# EAGLE design fib_backplate (EAGLE 9.5.1)
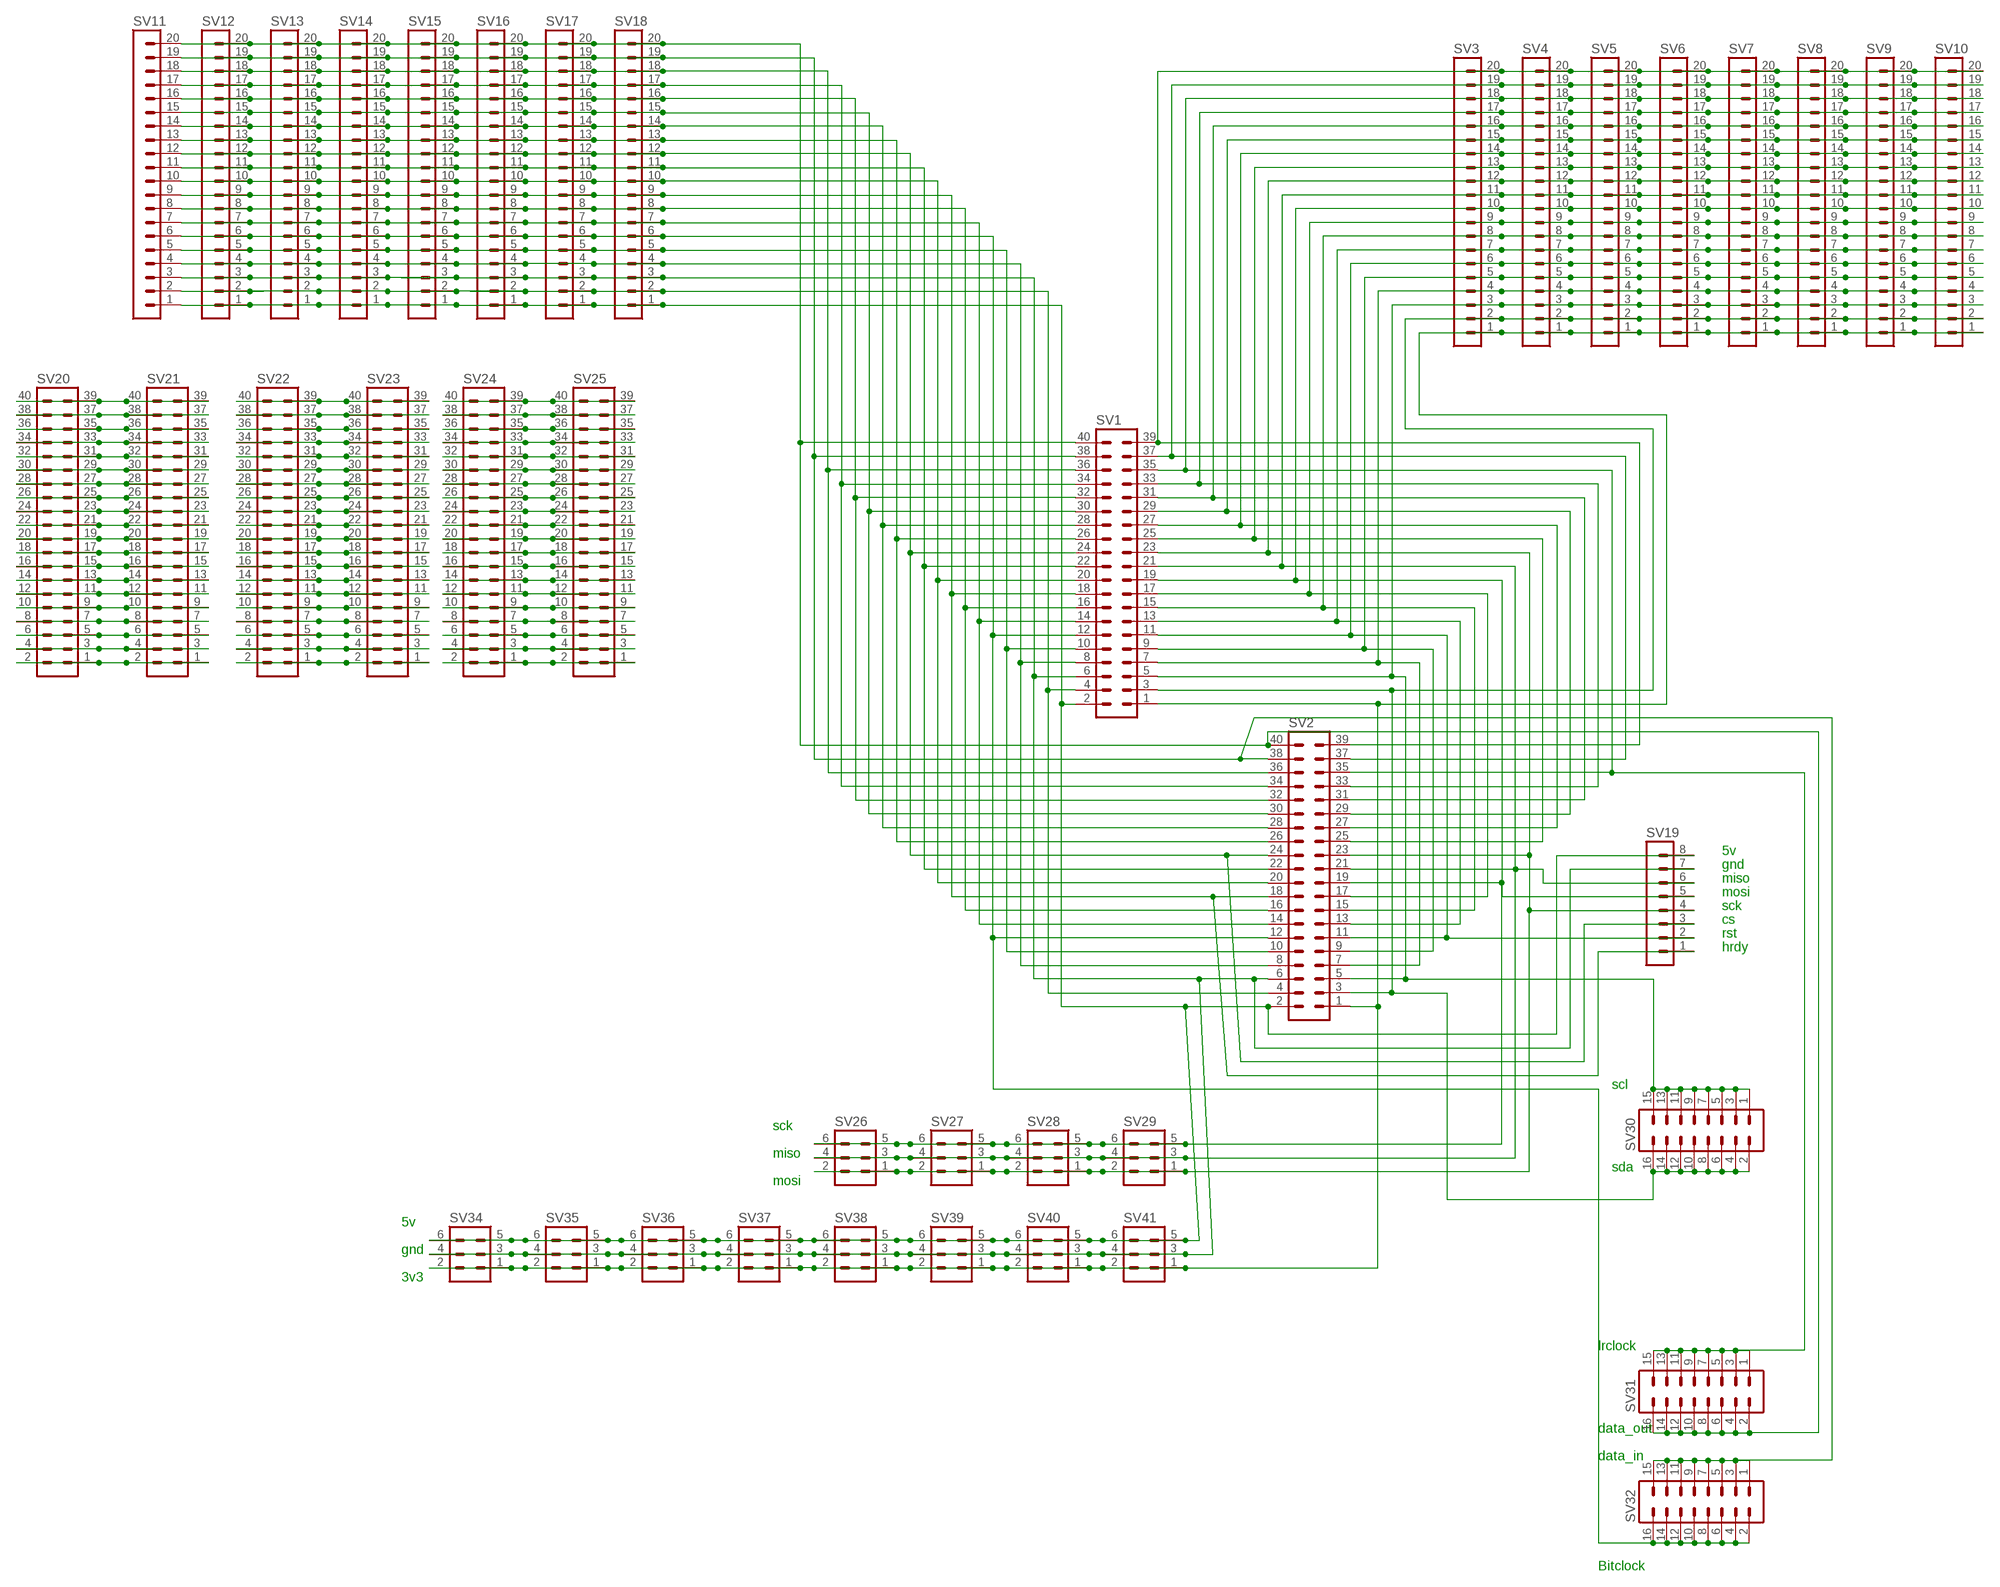
[diagram p0: schematic, sheet 1]

## Parts
SV1  MA20-2  [MA20-2]
SV2  MA20-2  [MA20-2]
SV3  MA20-1L  [MA20-1L]
SV4  MA20-1L  [MA20-1L]
SV5  MA20-1L  [MA20-1L]
SV6  MA20-1L  [MA20-1L]
SV7  MA20-1L  [MA20-1L]
SV8  MA20-1L  [MA20-1L]
SV9  MA20-1L  [MA20-1L]
SV10  MA20-1L  [MA20-1L]
SV11  MA20-1L  [MA20-1L]
SV12  MA20-1L  [MA20-1L]
SV13  MA20-1L  [MA20-1L]
SV14  MA20-1L  [MA20-1L]
SV15  MA20-1L  [MA20-1L]
SV16  MA20-1L  [MA20-1L]
SV17  MA20-1L  [MA20-1L]
SV18  MA20-1L  [MA20-1L]
SV19  MA08-1  [MA08-1]
SV20  MA20-2  [MA20-2]
SV21  MA20-2  [MA20-2]
SV22  MA20-2  [MA20-2]
SV23  MA20-2  [MA20-2]
SV24  MA20-2  [MA20-2]
SV25  MA20-2  [MA20-2]
SV26  MA03-2  [MA03-2]
SV27  MA03-2  [MA03-2]
SV28  MA03-2  [MA03-2]
SV29  MA03-2  [MA03-2]
SV30  MA08-2  [MA08-2]
SV31  MA08-2  [MA08-2]
SV32  MA08-2  [MA08-2]
SV34  MA03-2  [MA03-2]
SV35  MA03-2  [MA03-2]
SV36  MA03-2  [MA03-2]
SV37  MA03-2  [MA03-2]
SV38  MA03-2  [MA03-2]
SV39  MA03-2  [MA03-2]
SV40  MA03-2  [MA03-2]
SV41  MA03-2  [MA03-2]

## Nets
N$1 [Tracks]: SV1.4 SV2.4 SV11.2 SV12.2 SV13.2 SV14.2 SV15.2 SV16.2 SV17.2 SV18.2
N$3 [Tracks]: SV1.8 SV2.8 SV11.4 SV12.4 SV13.4 SV14.4 SV15.4 SV16.4 SV17.4 SV18.4
N$4 [Tracks]: SV1.10 SV2.10 SV11.5 SV12.5 SV13.5 SV14.5 SV15.5 SV16.5 SV17.5 SV18.5
N$5 [Tracks]: SV1.35 SV2.35 SV3.18 SV4.18 SV5.18 SV6.18 SV7.18 SV8.18 SV9.18 SV10.18 SV31.1 SV31.3 SV31.5 SV31.7 SV31.9 SV31.11 SV31.13 SV31.15
N$7 [Tracks]: SV1.12 SV2.12 SV11.6 SV12.6 SV13.6 SV14.6 SV15.6 SV16.6 SV17.6 SV18.6 SV32.2 SV32.4 SV32.6 SV32.8 SV32.10 SV32.12 SV32.14 SV32.16
N$8 [Tracks]: SV1.14 SV2.14 SV11.7 SV12.7 SV13.7 SV14.7 SV15.7 SV16.7 SV17.7 SV18.7
N$9 [Tracks]: SV1.5 SV2.5 SV3.3 SV4.3 SV5.3 SV6.3 SV7.3 SV8.3 SV9.3 SV10.3 SV30.1 SV30.3 SV30.5 SV30.7 SV30.9 SV30.11 SV30.13 SV30.15
N$10 [Tracks]: SV1.7 SV2.7 SV3.4 SV4.4 SV5.4 SV6.4 SV7.4 SV8.4 SV9.4 SV10.4
N$11 [Tracks]: SV1.9 SV2.9 SV3.5 SV4.5 SV5.5 SV6.5 SV7.5 SV8.5 SV9.5 SV10.5
N$12 [Tracks]: SV20.39 SV20.40 SV21.39 SV21.40
N$13 [Tracks]: SV1.11 SV2.11 SV3.6 SV4.6 SV5.6 SV6.6 SV7.6 SV8.6 SV9.6 SV10.6 SV19.2
N$14 [Tracks]: SV1.18 SV2.18 SV11.9 SV12.9 SV13.9 SV14.9 SV15.9 SV16.9 SV17.9 SV18.9 SV19.1
N$15 [Tracks]: SV20.37 SV20.38 SV21.37 SV21.38
N$16 [Tracks]: SV1.13 SV2.13 SV3.7 SV4.7 SV5.7 SV6.7 SV7.7 SV8.7 SV9.7 SV10.7
N$17 [Tracks]: SV1.22 SV2.22 SV11.11 SV12.11 SV13.11 SV14.11 SV15.11 SV16.11 SV17.11 SV18.11
N$18 [Tracks]: SV1.15 SV2.15 SV3.8 SV4.8 SV5.8 SV6.8 SV7.8 SV8.8 SV9.8 SV10.8
N$19 [Tracks]: SV20.35 SV20.36 SV21.35 SV21.36
N$20 [Tracks]: SV1.17 SV2.17 SV3.9 SV4.9 SV5.9 SV6.9 SV7.9 SV8.9 SV9.9 SV10.9
N$21 [Tracks]: SV20.33 SV20.34 SV21.33 SV21.34
N$22 [Tracks]: SV1.25 SV2.25 SV3.13 SV4.13 SV5.13 SV6.13 SV7.13 SV8.13 SV9.13 SV10.13
N$23 [Tracks]: SV20.31 SV20.32 SV21.31 SV21.32
N$25 [Tracks]: SV20.29 SV20.30 SV21.29 SV21.30
N$27 [Tracks]: SV20.27 SV20.28 SV21.27 SV21.28
N$28 [Tracks]: SV1.27 SV2.27 SV3.14 SV4.14 SV5.14 SV6.14 SV7.14 SV8.14 SV9.14 SV10.14
N$29 [Tracks]: SV20.25 SV20.26 SV21.25 SV21.26
N$30 [Tracks]: SV1.29 SV2.29 SV3.15 SV4.15 SV5.15 SV6.15 SV7.15 SV8.15 SV9.15 SV10.15
N$31 [Tracks]: SV1.31 SV2.31 SV3.16 SV4.16 SV5.16 SV6.16 SV7.16 SV8.16 SV9.16 SV10.16
N$32 [Tracks]: SV20.23 SV20.24 SV21.23 SV21.24
N$33 [Tracks]: SV20.21 SV20.22 SV21.21 SV21.22
N$34 [Tracks]: SV1.28 SV2.28 SV11.14 SV12.14 SV13.14 SV14.14 SV15.14 SV16.14 SV17.14 SV18.14
N$35 [Tracks]: SV1.33 SV2.33 SV3.17 SV4.17 SV5.17 SV6.17 SV7.17 SV8.17 SV9.17 SV10.17
N$36 [Tracks]: SV1.32 SV2.32 SV11.16 SV12.16 SV13.16 SV14.16 SV15.16 SV16.16 SV17.16 SV18.16
N$38 [Tracks]: SV1.36 SV2.36 SV11.18 SV12.18 SV13.18 SV14.18 SV15.18 SV16.18 SV17.18 SV18.18
N$39 [Tracks]: SV1.37 SV2.37 SV3.19 SV4.19 SV5.19 SV6.19 SV7.19 SV8.19 SV9.19 SV10.19
N$40 [Tracks]: SV20.19 SV20.20 SV21.19 SV21.20
N$41 [Tracks]: SV1.26 SV2.26 SV11.13 SV12.13 SV13.13 SV14.13 SV15.13 SV16.13 SV17.13 SV18.13
N$42 [Tracks]: SV20.17 SV20.18 SV21.17 SV21.18
N$43 [Tracks]: SV1.30 SV2.30 SV11.15 SV12.15 SV13.15 SV14.15 SV15.15 SV16.15 SV17.15 SV18.15
N$44 [Tracks]: SV20.15 SV20.16 SV21.15 SV21.16
N$45 [Tracks]: SV1.34 SV2.34 SV11.17 SV12.17 SV13.17 SV14.17 SV15.17 SV16.17 SV17.17 SV18.17
N$46 [Tracks]: SV20.13 SV20.14 SV21.13 SV21.14
N$47 [Tracks]: SV1.38 SV2.38 SV11.19 SV12.19 SV13.19 SV14.19 SV15.19 SV16.19 SV17.19 SV18.19 SV32.1 SV32.3 SV32.5 SV32.7 SV32.9 SV32.11 SV32.13 SV32.15
N$48 [Tracks]: SV1.40 SV2.40 SV11.20 SV12.20 SV13.20 SV14.20 SV15.20 SV16.20 SV17.20 SV18.20 SV31.2 SV31.4 SV31.6 SV31.8 SV31.10 SV31.12 SV31.14 SV31.16
N$49 [Tracks]: SV20.11 SV20.12 SV21.11 SV21.12
N$50 [Tracks]: SV20.9 SV20.10 SV21.9 SV21.10
N$51 [Tracks]: SV20.7 SV20.8 SV21.7 SV21.8
N$52 [Tracks]: SV20.5 SV20.6 SV21.5 SV21.6
N$53 [Tracks]: SV20.3 SV20.4 SV21.3 SV21.4
N$54 [Tracks]: SV20.1 SV20.2 SV21.1 SV21.2
N$55 [Tracks]: SV22.39 SV22.40 SV23.39 SV23.40
N$56 [Tracks]: SV22.37 SV22.38 SV23.37 SV23.38
N$57 [Tracks]: SV22.35 SV22.36 SV23.35 SV23.36
N$58 [Tracks]: SV22.33 SV22.34 SV23.33 SV23.34
N$59 [Tracks]: SV22.31 SV22.32 SV23.31 SV23.32
N$60 [Tracks]: SV22.29 SV22.30 SV23.29 SV23.30
N$61 [Tracks]: SV22.27 SV22.28 SV23.27 SV23.28
N$62 [Tracks]: SV22.25 SV22.26 SV23.25 SV23.26
N$63 [Tracks]: SV22.23 SV22.24 SV23.23 SV23.24
N$64 [Tracks]: SV22.21 SV22.22 SV23.21 SV23.22
N$65 [Tracks]: SV22.19 SV22.20 SV23.19 SV23.20
N$66 [Tracks]: SV22.17 SV22.18 SV23.17 SV23.18
N$67 [Tracks]: SV22.15 SV22.16 SV23.15 SV23.16
N$68 [Tracks]: SV22.13 SV22.14 SV23.13 SV23.14
N$69 [Tracks]: SV22.11 SV22.12 SV23.11 SV23.12
N$70 [Tracks]: SV22.9 SV22.10 SV23.9 SV23.10
N$71 [Tracks]: SV22.7 SV22.8 SV23.7 SV23.8
N$72 [Tracks]: SV22.5 SV22.6 SV23.5 SV23.6
N$73 [Tracks]: SV22.3 SV22.4 SV23.3 SV23.4
N$74 [Tracks]: SV22.1 SV22.2 SV23.1 SV23.2
N$75 [Tracks]: SV24.39 SV24.40 SV25.39 SV25.40
N$76 [Tracks]: SV24.37 SV24.38 SV25.37 SV25.38
N$77 [Tracks]: SV24.35 SV24.36 SV25.35 SV25.36
N$78 [Tracks]: SV24.33 SV24.34 SV25.33 SV25.34
N$79 [Tracks]: SV24.31 SV24.32 SV25.31 SV25.32
N$80 [Tracks]: SV24.29 SV24.30 SV25.29 SV25.30
N$81 [Tracks]: SV24.27 SV24.28 SV25.27 SV25.28
N$82 [Tracks]: SV24.25 SV24.26 SV25.25 SV25.26
N$83 [Tracks]: SV24.23 SV24.24 SV25.23 SV25.24
N$84 [Tracks]: SV24.21 SV24.22 SV25.21 SV25.22
N$85 [Tracks]: SV24.19 SV24.20 SV25.19 SV25.20
N$86 [Tracks]: SV24.17 SV24.18 SV25.17 SV25.18
N$87 [Tracks]: SV24.15 SV24.16 SV25.15 SV25.16
N$88 [Tracks]: SV24.13 SV24.14 SV25.13 SV25.14
N$89 [Tracks]: SV24.11 SV24.12 SV25.11 SV25.12
N$90 [Tracks]: SV24.9 SV24.10 SV25.9 SV25.10
N$91 [Tracks]: SV24.7 SV24.8 SV25.7 SV25.8
N$92 [Tracks]: SV24.5 SV24.6 SV25.5 SV25.6
N$93 [Tracks]: SV24.3 SV24.4 SV25.3 SV25.4
N$94 [Tracks]: SV24.1 SV24.2 SV25.1 SV25.2
N$95 [Tracks]: SV1.19 SV2.19 SV3.10 SV4.10 SV5.10 SV6.10 SV7.10 SV8.10 SV9.10 SV10.10 SV19.5 SV26.5 SV26.6 SV27.5 SV27.6 SV28.5 SV28.6 SV29.5 SV29.6
N$96 [Tracks]: SV1.21 SV2.21 SV3.11 SV4.11 SV5.11 SV6.11 SV7.11 SV8.11 SV9.11 SV10.11 SV19.6 SV26.3 SV26.4 SV27.3 SV27.4 SV28.3 SV28.4 SV29.3 SV29.4
N$97 [Tracks]: SV1.23 SV2.23 SV3.12 SV4.12 SV5.12 SV6.12 SV7.12 SV8.12 SV9.12 SV10.12 SV19.4 SV26.1 SV26.2 SV27.1 SV27.2 SV28.1 SV28.2 SV29.1 SV29.2
N$101 [Tracks]: SV1.2 SV2.2 SV11.1 SV12.1 SV13.1 SV14.1 SV15.1 SV16.1 SV17.1 SV18.1 SV19.8 SV34.5 SV34.6 SV35.5 SV35.6 SV36.5 SV36.6 SV37.5 SV37.6 SV38.5 SV38.6 SV39.5 SV39.6 SV40.5 SV40.6 SV41.5 SV41.6
N$105 [Tracks]: SV1.6 SV2.6 SV11.3 SV12.3 SV13.3 SV14.3 SV15.3 SV16.3 SV17.3 SV18.3 SV19.7 SV34.3 SV34.4 SV35.3 SV35.4 SV36.3 SV36.4 SV37.3 SV37.4 SV38.3 SV38.4 SV39.3 SV39.4 SV40.3 SV40.4 SV41.3 SV41.4
N$106 [Tracks]: SV1.1 SV2.1 SV3.1 SV4.1 SV5.1 SV6.1 SV7.1 SV8.1 SV9.1 SV10.1 SV34.1 SV34.2 SV35.1 SV35.2 SV36.1 SV36.2 SV37.1 SV37.2 SV38.1 SV38.2 SV39.1 SV39.2 SV40.1 SV40.2 SV41.1 SV41.2
N$322 [Tracks]: SV1.3 SV2.3 SV3.2 SV4.2 SV5.2 SV6.2 SV7.2 SV8.2 SV9.2 SV10.2 SV30.2 SV30.4 SV30.6 SV30.8 SV30.10 SV30.12 SV30.14 SV30.16
N$340 [Tracks]: SV1.39 SV2.39 SV3.20 SV4.20 SV5.20 SV6.20 SV7.20 SV8.20 SV9.20 SV10.20
N$348 [Tracks]: SV1.16 SV2.16 SV11.8 SV12.8 SV13.8 SV14.8 SV15.8 SV16.8 SV17.8 SV18.8
N$606 [Tracks]: SV1.24 SV2.24 SV11.12 SV12.12 SV13.12 SV14.12 SV15.12 SV16.12 SV17.12 SV18.12 SV19.3
N$607 [Tracks]: SV1.20 SV2.20 SV11.10 SV12.10 SV13.10 SV14.10 SV15.10 SV16.10 SV17.10 SV18.10

## Notes on the sheet
- 5v
- gnd
- miso
- mosi
- sck
- cs
- rst
- hrdy
- scl
- sck
- miso
- sda
- mosi
- 5v
- gnd
- 3v3
- lrclock
- data_out
- data_in
- Bitclock

## Library data of the parts
SV1 SV2 SV20-SV25 = con-lstb:MA20-2: PIN HEADER; OC_FARNELL: unknown; OC_NEWARK: unknown
SV3-SV18 = con-lstb:MA20-1L: PIN HEADER; OC_FARNELL: unknown; OC_NEWARK: unknown
SV19 = con-lstb:MA08-1: PIN HEADER; OC_FARNELL: unknown; OC_NEWARK: unknown
SV26-SV29 SV34-SV41 = con-lstb:MA03-2: PIN HEADER; OC_FARNELL: unknown; OC_NEWARK: unknown
SV30-SV32 = con-lstb:MA08-2: PIN HEADER; OC_FARNELL: unknown; OC_NEWARK: unknown

## Net classes
1 Tracks: width 0.254 mm

## Board
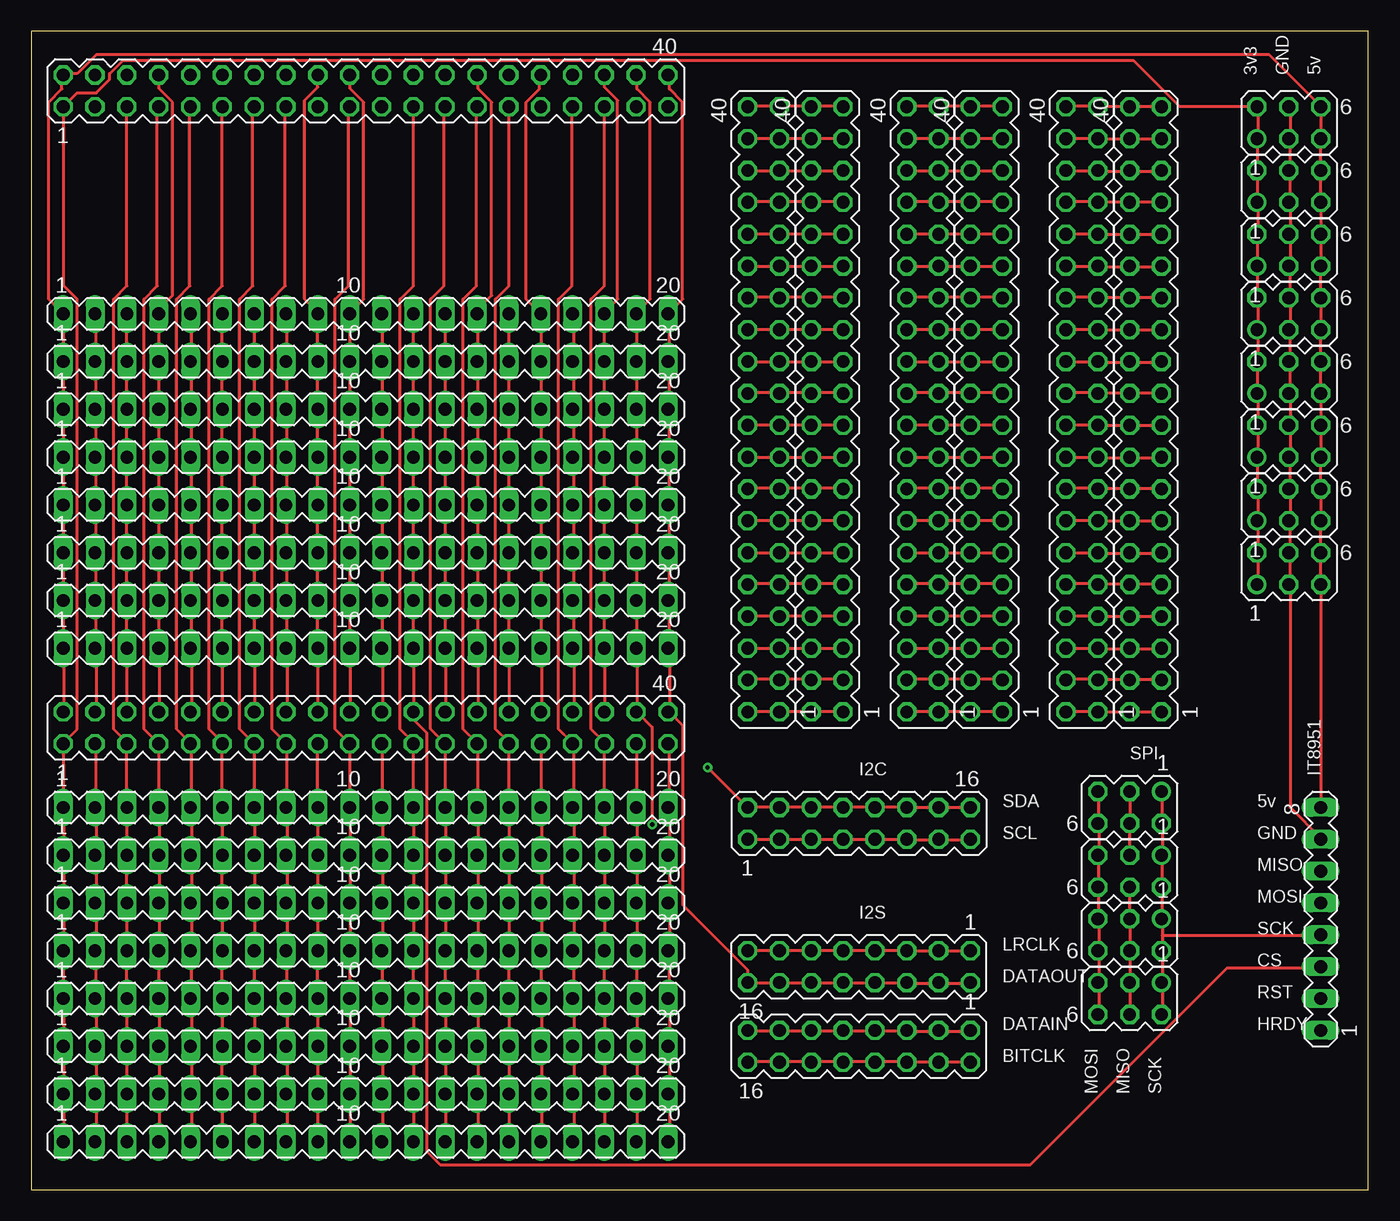
[diagram p1: board, top side]
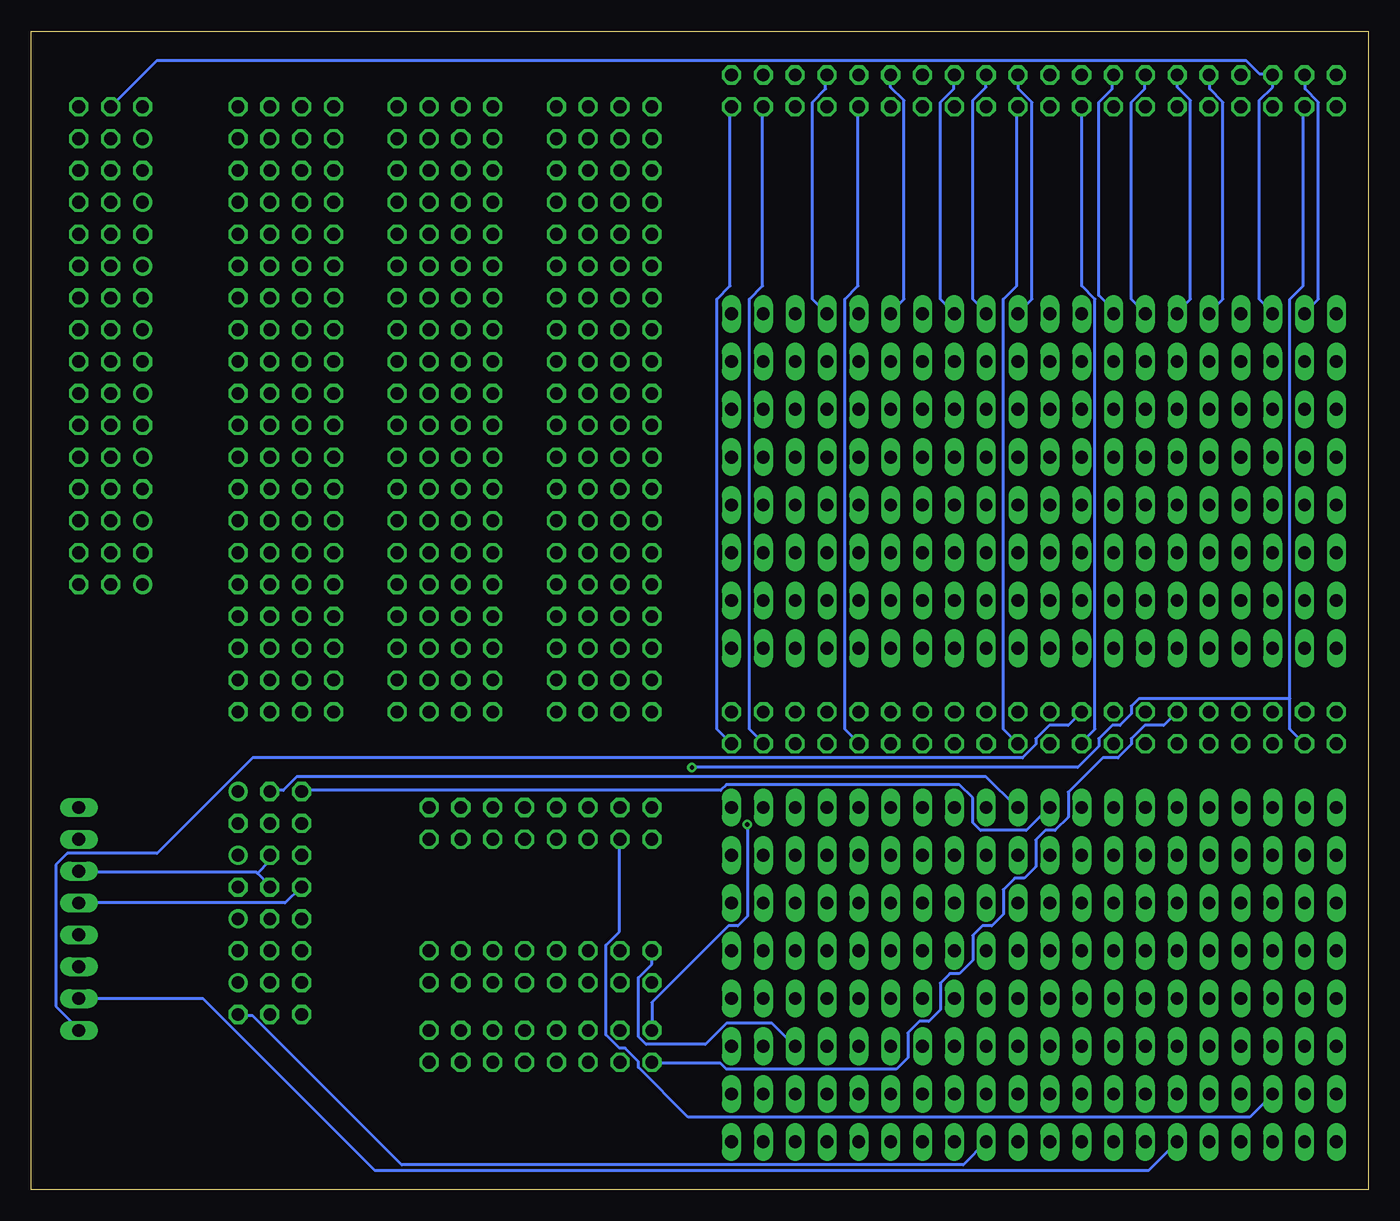
[diagram p2: board, bottom side, seen from below]

Size 106.66 x 92.38 mm. Coordinates in mm from the lower left corner, seen from the top.
Outline: 0,0 106.66,0 106.66,92.38 0,92.38 0,0
Copper layers (1*16): Top 0.035mm / dielectric 1.5mm / Bottom 0.035mm
Design rules "default": minimum track width 6mil, minimum drill 0.35mm, track to track 6mil, track to pad 6mil, pad to pad 6mil, via to via 6mil, smd to smd 6mil, copper to edge 40mil, drill to drill 6mil, minimum pad ring 10mil, minimum via ring 8mil, stop-mask expansion 4mil, vias tented up to drill 0mil, thermal gap 10mil

### Footprints (pad centres in the part's own frame; a part is rotated, then mirrored left to right if it is on the bottom)
MA20-2 = drill 1.016 octagon: 1 -24.13,-1.27; 2 -24.13,1.27; 3 -21.59,-1.27; 4 -21.59,1.27; 5 -19.05,-1.27; 6 -19.05,1.27; 7 -16.51,-1.27; 8 -16.51,1.27; 9 -13.97,-1.27; 10 -13.97,1.27; 11 -11.43,-1.27; 12 -11.43,1.27; 13 -8.89,-1.27; 14 -8.89,1.27; 15 -6.35,-1.27; 16 -6.35,1.27; 17 -3.81,-1.27; 18 -3.81,1.27; 19 -1.27,-1.27; 20 -1.27,1.27; 21 1.27,-1.27; 22 1.27,1.27; 23 3.81,-1.27; 24 3.81,1.27; 25 6.35,-1.27; 26 6.35,1.27; 27 8.89,-1.27; 28 8.89,1.27; 29 11.43,-1.27; 30 11.43,1.27; 31 13.97,-1.27; 32 13.97,1.27; 33 16.51,-1.27; 34 16.51,1.27; 35 19.05,-1.27; 36 19.05,1.27; 37 21.59,-1.27; 38 21.59,1.27; 39 24.13,-1.27; 40 24.13,1.27
MA20-1L = drill 1.016 long: 1 24.13,0; 2 21.59,0; 3 19.05,0; 4 16.51,0; 5 13.97,0; 6 11.43,0; 7 8.89,0; 8 6.35,0; 9 3.81,0; 10 1.27,0; 11 -1.27,0; 12 -3.81,0; 13 -6.35,0; 14 -8.89,0; 15 -11.43,0; 16 -13.97,0; 17 -16.51,0; 18 -19.05,0; 19 -21.59,0; 20 -24.13,0
MA08-1 = drill 1.016 long: 1 -8.89,0; 2 -6.35,0; 3 -3.81,0; 4 -1.27,0; 5 1.27,0; 6 3.81,0; 7 6.35,0; 8 8.89,0
MA03-2 = drill 1.016: 1 -2.54,-1.27 | drill 1.016 octagon: 2 -2.54,1.27; 3 0,-1.27; 4 0,1.27; 5 2.54,-1.27; 6 2.54,1.27
MA08-2 = drill 1.016 octagon: 1 -8.89,-1.27; 2 -8.89,1.27; 3 -6.35,-1.27; 4 -6.35,1.27; 5 -3.81,-1.27; 6 -3.81,1.27; 7 -1.27,-1.27; 8 -1.27,1.27; 9 1.27,-1.27; 10 1.27,1.27; 11 3.81,-1.27; 12 3.81,1.27; 13 6.35,-1.27; 14 6.35,1.27; 15 8.89,-1.27; 16 8.89,1.27

### Placement (x,y rotation side)
SV1  26.67,87.63 0 top
SV2  26.67,36.83 0 top
SV3  26.67,15.24 180 top
SV4  26.67,30.48 180 top
SV5  26.67,11.43 180 top
SV6  26.67,26.67 180 top
SV7  26.67,7.62 180 top
SV8  26.67,22.86 180 top
SV9  26.67,3.81 180 top
SV10  26.67,19.05 180 top
SV11  26.67,69.85 180 top
SV12  26.67,54.61 180 top
SV13  26.67,66.04 180 top
SV14  26.67,50.8 180 top
SV15  26.67,62.23 180 top
SV16  26.67,46.99 180 top
SV17  26.67,58.42 180 top
SV18  26.67,43.18 180 top
SV19  102.87,21.59 90 top
SV20  76.2,62.23 90 top
SV21  71.12,62.23 90 top
SV22  88.9,62.23 90 top
SV23  83.82,62.23 90 top
SV24  63.5,62.23 90 top
SV25  58.42,62.23 90 top
SV26  87.63,15.24 180 top
SV27  87.63,20.32 180 top
SV28  87.63,25.4 180 top
SV29  87.63,30.48 180 top
SV30  66.04,29.21 0 top
SV31  66.04,17.78 180 top
SV32  66.04,11.43 180 top
SV34  100.33,49.53 0 top
SV35  100.33,54.61 0 top
SV36  100.33,59.69 0 top
SV37  100.33,64.77 0 top
SV38  100.33,69.85 0 top
SV39  100.33,74.93 0 top
SV40  100.33,80.01 0 top
SV41  100.33,85.09 0 top

### Tracks (layer width: path | path; a pad name or v marks a point on that pad's centre or on a via)
N$1
  Top 0.254: SV2.4 5.18,38.1 5.18,43.13 SV18.2 5.18,43.28 5.18,46.94 SV16.2 5.18,47.09 5.18,50.75 SV14.2 5.18,50.9 5.18,54.56 SV12.2 5.18,54.71 5.18,58.37 SV17.2 5.18,58.52 5.18,62.18 SV15.2 5.18,62.33 5.18,65.99 SV13.2 5.18,66.14 5.18,69.8 SV11.2
  Bottom 0.254: SV1.4 5.03,88.85 5.03,87.78 3.96,86.72 3.96,71.02 5.03,69.95 SV11.2
N$3
  Top 0.254: SV2.8 10.21,38.1 10.21,43.13 SV18.4 10.21,43.28 10.21,46.94 SV16.4 10.21,47.09 10.21,50.75 SV14.4 10.21,50.9 10.21,54.56 SV12.4 10.21,54.71 10.21,58.37 SV17.4 10.21,58.52 10.21,62.18 SV15.4 10.21,62.33 10.21,65.99 SV13.4 10.21,66.14 10.21,69.8 SV11.4 10.21,69.95 10.21,70.26 11.28,71.32 11.28,86.72 10.21,87.78 10.21,88.85 SV1.8
N$4
  Top 0.254: SV2.10 12.8,38.1 12.8,43.13 SV18.5 12.8,43.28 12.8,46.94 SV16.5 12.8,47.09 12.8,50.75 SV14.5 12.8,50.9 12.8,54.56 SV12.5 12.8,54.71 12.8,58.37 SV17.5 12.8,58.52 12.8,62.18 SV15.5 12.8,62.33 12.8,65.99 SV13.5 12.8,66.14 12.8,69.8 SV11.5
  Bottom 0.254: SV1.10 12.65,88.85 12.65,87.78 11.58,86.72 11.58,71.02 12.65,69.95 SV11.5
N$5
  Top 0.254: SV31.15 SV31.13 SV31.11 SV31.9 SV31.7 SV31.5 SV31.3 SV31.1 | SV9.18 SV7.18 SV5.18 SV3.18 SV10.18 SV8.18 SV6.18 SV4.18 SV2.35 45.72,35.66 44.65,36.73 44.65,71.02 45.72,72.08 SV1.35
  Bottom 0.254: SV31.15 57.15,17.98 58.22,16.92 58.22,12.19 57.61,11.58 52.88,11.58 51.21,13.26 47.55,13.26 SV5.18
N$7
  Top 0.254: SV32.16 57.15,10.21 59.59,10.21 SV32.14 59.74,10.21 62.18,10.21 SV32.12 62.33,10.21 64.77,10.21 | 72.39,10.21 69.95,10.21 SV32.6 69.8,10.21 67.36,10.21 SV32.8 67.21,10.21 64.77,10.21 | 72.39,10.21 74.83,10.21 SV32.2 | 72.39,10.21 SV32.4 | 64.77,10.21 SV32.10 | SV2.12 SV18.6 SV16.6 SV14.6 SV12.6 SV17.6 SV15.6 SV13.6 SV11.6
  Bottom 0.254: SV1.12 15.24,87.94 14.17,86.87 14.17,71.02 15.24,69.95 SV11.6 | SV2.12 16.31,37.03 17.83,37.03 18.9,35.97 18.9,35.51 19.96,34.44 21.18,34.44 23.93,31.7 23.93,29.72 24.99,28.65 25.76,28.65 26.52,27.89 26.52,25.76 27.43,24.84 28.19,24.84 29.11,23.93 29.11,21.95 30.02,21.03 30.79,21.03 31.55,20.27 31.55,18.29 32.61,17.22 33.38,17.22 34.14,16.46 34.14,14.33 35.05,13.41 35.81,13.41 36.73,12.5 36.73,10.52 37.64,9.6 51.21,9.6 51.66,10.06 57.15,10.06 SV32.16
N$8
  Top 0.254: SV2.14 17.83,38.1 17.83,43.13 SV18.7 17.83,43.28 17.83,46.94 SV16.7 17.83,47.09 17.83,50.75 SV14.7 17.83,50.9 17.83,54.56 SV12.7 17.83,54.71 17.83,58.37 SV17.7 17.83,58.52 17.83,62.18 SV15.7 17.83,62.33 17.83,65.99 SV13.7 17.83,66.14 17.83,69.8 SV11.7
  Bottom 0.254: SV1.14 17.83,88.85 17.83,87.78 18.9,86.72 18.9,71.02 17.83,69.95 SV11.7
N$9
  Top 0.254: SV1.5 7.62,72.08 6.55,71.02 6.55,36.73 7.62,35.66 SV2.5 SV4.3 SV6.3 SV8.3 SV10.3 SV3.3 SV5.3 SV7.3 SV9.3 | SV30.1 57.15,27.89 59.59,27.89 SV30.3 59.74,27.89 62.18,27.89 SV30.5 62.33,27.89 64.77,27.89 | 72.39,27.89 69.95,27.89 SV30.11 69.8,27.89 67.36,27.89 SV30.9 67.21,27.89 64.77,27.89 | 72.39,27.89 74.83,27.89 SV30.15 | 72.39,27.89 SV30.13 | 64.77,27.89 SV30.7
  Bottom 0.254: SV7.3 9.45,5.79 54.25,5.79 58.22,9.75 58.22,10.21 59.28,11.28 59.74,11.28 60.81,12.34 60.81,19.51 59.74,20.57 59.74,27.89 SV30.3
N$10
  Top 0.254: 10.21,22.86 10.21,19.05 | 10.21,7.62 10.21,3.81 SV9.4 | 10.21,15.24 10.21,11.43 | 10.21,11.43 10.21,7.62 | 10.21,7.62 SV7.4 | 10.21,11.43 SV5.4 | 10.21,15.24 10.21,19.05 | 10.21,19.05 SV10.4 | 10.21,15.24 SV3.4 | 10.21,30.48 10.21,26.67 | 10.21,30.48 10.21,35.51 SV2.7 8.99,36.73 8.99,71.02 10.06,72.08 10.06,86.26 SV1.7 | 10.21,30.48 SV4.4 | 10.21,26.67 10.21,22.86 | 10.21,22.86 SV8.4 | 10.21,26.67 SV6.4
N$11
  Top 0.254: 12.8,22.86 12.8,19.05 | 12.8,7.62 12.8,3.81 SV9.5 | 12.8,15.24 12.8,11.43 | 12.8,11.43 12.8,7.62 | 12.8,7.62 SV7.5 | 12.8,11.43 SV5.5 | 12.8,15.24 12.8,19.05 | 12.8,19.05 SV10.5 | 12.8,15.24 SV3.5 | 12.8,30.48 12.8,26.67 | 12.8,30.48 12.8,35.51 SV2.9 12.65,35.66 11.58,36.73 11.58,71.02 12.65,72.08 12.65,86.26 SV1.9 | 12.8,30.48 SV4.5 | 12.8,26.67 12.8,22.86 | 12.8,22.86 SV8.5 | 12.8,26.67 SV6.5
N$12
  Top 0.254: 72.39,86.41 69.95,86.41 SV21.40 | SV20.39 77.42,86.41 74.98,86.41 SV20.40 74.83,86.41 72.39,86.41 | 72.39,86.41 SV21.39
N$13
  Top 0.254: SV1.11 15.24,72.08 14.17,71.02 14.17,36.73 15.24,35.66 SV2.11 SV4.6 SV6.6 SV8.6 SV10.6 SV3.6 SV5.6 SV7.6 SV9.6
  Bottom 0.254: SV19.2 92.96,15.24 79.25,1.52 17.53,1.52 SV9.6
N$14
  Top 0.254: SV2.18 SV18.9 SV16.9 SV14.9 SV12.9 SV17.9 SV15.9 SV13.9 SV11.9 22.86,69.95 21.79,71.02 21.79,86.87 22.86,87.94 SV1.18
  Bottom 0.254: SV2.18 23.93,37.03 25.45,37.03 26.52,35.97 26.52,35.51 27.58,34.44 89,34.44 96.62,26.82 103.78,26.82 104.7,25.91 104.7,14.63 102.87,12.8 SV19.1
N$15
  Top 0.254: SV21.38 SV21.37 SV20.38 SV20.37
N$16
  Top 0.254: 17.83,22.86 17.83,19.05 | 17.83,7.62 17.83,3.81 SV9.7 | 17.83,15.24 17.83,11.43 | 17.83,11.43 17.83,7.62 | 17.83,7.62 SV7.7 | 17.83,11.43 SV5.7 | 17.83,15.24 17.83,19.05 | 17.83,19.05 SV10.7 | 17.83,15.24 SV3.7 | 17.83,30.48 17.83,26.67 | 17.83,30.48 17.83,35.51 SV2.13 16.61,36.73 16.61,71.02 17.68,72.08 17.68,86.26 SV1.13 | 17.83,30.48 SV4.7 | 17.83,26.67 17.83,22.86 | 17.83,22.86 SV8.7 | 17.83,26.67 SV6.7
N$17
  Top 0.254: SV2.22 28.04,38.1 28.04,43.13 SV18.11 28.04,43.28 28.04,46.94 SV16.11 28.04,47.09 28.04,50.75 SV14.11 28.04,50.9 28.04,54.56 SV12.11 28.04,54.71 28.04,58.37 SV17.11 28.04,58.52 28.04,62.18 SV15.11 28.04,62.33 28.04,65.99 SV13.11 28.04,66.14 28.04,69.8 SV11.11
  Bottom 0.254: SV1.22 27.89,88.85 27.89,87.78 26.82,86.72 26.82,71.02 27.89,69.95 SV11.11
N$18
  Top 0.254: 20.42,22.86 20.42,19.05 | 20.42,7.62 20.42,3.81 SV9.8 | 20.42,15.24 20.42,11.43 | 20.42,11.43 20.42,7.62 | 20.42,7.62 SV7.8 | 20.42,11.43 SV5.8 | 20.42,15.24 20.42,19.05 | 20.42,19.05 SV10.8 | 20.42,15.24 SV3.8 | 20.42,30.48 20.42,26.67 | 20.42,30.48 20.42,35.51 SV2.15 20.27,35.66 19.2,36.73 19.2,71.02 20.27,72.08 20.27,86.26 SV1.15 | 20.42,30.48 SV4.8 | 20.42,26.67 20.42,22.86 | 20.42,22.86 SV8.8 | 20.42,26.67 SV6.8
N$19
  Top 0.254: 72.39,81.23 69.95,81.23 SV21.36 | SV20.35 77.42,81.23 74.98,81.23 SV20.36 74.83,81.23 72.39,81.23 | 72.39,81.23 SV21.35
N$20
  Top 0.254: SV9.9 SV7.9 SV5.9 SV3.9 SV10.9 SV8.9 SV6.9 SV4.9 SV2.17
  Bottom 0.254: SV1.17 22.86,72.08 21.79,71.02 21.79,36.73 22.86,35.66 SV2.17
N$21
  Top 0.254: 72.39,78.79 69.95,78.79 SV21.34 | SV20.33 77.42,78.79 74.98,78.79 SV20.34 74.83,78.79 72.39,78.79 | 72.39,78.79 SV21.33
N$22
  Top 0.254: 33.07,22.86 33.07,19.05 | 33.07,7.62 33.07,3.81 SV9.13 | 33.07,15.24 33.07,11.43 | 33.07,11.43 33.07,7.62 | 33.07,7.62 SV7.13 | 33.07,11.43 SV5.13 | 33.07,15.24 33.07,19.05 | 33.07,19.05 SV10.13 | 33.07,15.24 SV3.13 | 33.07,30.48 33.07,26.67 | 33.07,30.48 33.07,35.51 SV2.25 31.85,36.73 31.85,71.02 32.92,72.08 32.92,86.26 SV1.25 | 33.07,30.48 SV4.13 | 33.07,26.67 33.07,22.86 | 33.07,22.86 SV8.13 | 33.07,26.67 SV6.13
N$23
  Top 0.254: SV21.32 SV21.31 SV20.32 SV20.31
N$25
  Top 0.254: 72.39,73.61 69.95,73.61 SV21.30 | SV20.29 77.42,73.61 74.98,73.61 SV20.30 74.83,73.61 72.39,73.61 | 72.39,73.61 SV21.29
N$27
  Top 0.254: 72.39,71.17 69.95,71.17 SV21.28 | SV20.27 77.42,71.17 74.98,71.17 SV20.28 74.83,71.17 72.39,71.17 | 72.39,71.17 SV21.27
N$28
  Top 0.254: 35.66,22.86 35.66,19.05 | 35.66,7.62 35.66,3.81 SV9.14 | 35.66,15.24 35.66,11.43 | 35.66,11.43 35.66,7.62 | 35.66,7.62 SV7.14 | 35.66,11.43 SV5.14 | 35.66,15.24 35.66,19.05 | 35.66,19.05 SV10.14 | 35.66,15.24 SV3.14 | 35.66,30.48 35.66,26.67 | 35.66,30.48 35.66,35.51 SV2.27 35.51,35.66 34.44,36.73 34.44,71.02 35.51,72.08 35.51,86.26 SV1.27 | 35.66,30.48 SV4.14 | 35.66,26.67 35.66,22.86 | 35.66,22.86 SV8.14 | 35.66,26.67 SV6.14
N$29
  Top 0.254: SV21.26 SV21.25 SV20.26 SV20.25
N$30
  Top 0.254: SV9.15 SV7.15 SV5.15 SV3.15 SV10.15 SV8.15 SV6.15 SV4.15 SV2.29 38.1,35.66 37.03,36.73 37.03,71.02 38.1,72.08 SV1.29
N$31
  Top 0.254: 40.69,22.86 40.69,19.05 | 40.69,7.62 40.69,3.81 SV9.16 | 40.69,15.24 40.69,11.43 | 40.69,11.43 40.69,7.62 | 40.69,7.62 SV7.16 | 40.69,11.43 SV5.16 | 40.69,15.24 40.69,19.05 | 40.69,19.05 SV10.16 | 40.69,15.24 SV3.16 | 40.69,30.48 40.69,26.67 | 40.69,30.48 40.69,35.51 SV2.31 | 40.69,30.48 SV4.16 | 40.69,26.67 40.69,22.86 | 40.69,22.86 SV8.16 | 40.69,26.67 SV6.16
  Bottom 0.254: SV1.31 40.69,86.26 40.69,72.08 41.76,71.02 41.76,36.73 40.69,35.66 SV2.31
N$32
  Top 0.254: 72.39,65.99 69.95,65.99 SV21.24 | SV20.23 77.42,65.99 74.98,65.99 SV20.24 74.83,65.99 72.39,65.99 | 72.39,65.99 SV21.23
N$33
  Top 0.254: 72.39,63.55 69.95,63.55 SV21.22 | SV20.21 77.42,63.55 74.98,63.55 SV20.22 74.83,63.55 72.39,63.55 | 72.39,63.55 SV21.21
N$34
  Top 0.254: SV2.28 35.66,38.1 35.66,43.13 SV18.14 35.66,43.28 35.66,46.94 SV16.14 35.66,47.09 35.66,50.75 SV14.14 35.66,50.9 35.66,54.56 SV12.14 35.66,54.71 35.66,58.37 SV17.14 35.66,58.52 35.66,62.18 SV15.14 35.66,62.33 35.66,65.99 SV13.14 35.66,66.14 35.66,69.8 SV11.14 35.66,69.95 35.66,70.26 36.73,71.32 36.73,86.72 35.66,87.78 35.66,88.85 SV1.28
N$35
  Top 0.254: 43.28,22.86 43.28,19.05 | 43.28,7.62 43.28,3.81 SV9.17 | 43.28,15.24 43.28,11.43 | 43.28,11.43 43.28,7.62 | 43.28,7.62 SV7.17 | 43.28,11.43 SV5.17 | 43.28,15.24 43.28,19.05 | 43.28,19.05 SV10.17 | 43.28,15.24 SV3.17 | 43.28,30.48 43.28,26.67 | 43.28,30.48 43.28,35.51 SV2.33 43.13,35.66 42.06,36.73 42.06,71.02 43.13,72.08 43.13,86.26 SV1.33 | 43.28,30.48 SV4.17 | 43.28,26.67 43.28,22.86 | 43.28,22.86 SV8.17 | 43.28,26.67 SV6.17
N$36
  Top 0.254: SV2.32 40.69,38.1 40.69,43.13 SV18.16 40.69,43.28 40.69,46.94 SV16.16 40.69,47.09 40.69,50.75 SV14.16 40.69,50.9 40.69,54.56 SV12.16 40.69,54.71 40.69,58.37 SV17.16 40.69,58.52 40.69,62.18 SV15.16 40.69,62.33 40.69,65.99 SV13.16 40.69,66.14 40.69,69.8 SV11.16 39.47,71.02 39.47,86.72 40.54,87.78 40.54,88.85 SV1.32
N$38
  Top 0.254: SV2.36 SV18.18 SV16.18 SV14.18 SV12.18 SV17.18 SV15.18 SV13.18 SV11.18 45.72,69.95 46.79,71.02 46.79,86.87 45.72,87.94 SV1.36
N$39
  Top 0.254: 48.31,22.86 48.31,19.05 | 48.31,7.62 48.31,3.81 SV9.19 | 48.31,15.24 48.31,11.43 | 48.31,11.43 48.31,7.62 | 48.31,7.62 SV7.19 | 48.31,11.43 SV5.19 | 48.31,15.24 48.31,19.05 | 48.31,19.05 SV10.19 | 48.31,15.24 SV3.19 | 48.31,30.48 48.31,26.67 | 48.31,30.48 48.31,35.51 SV2.37 | 48.31,30.48 SV4.19 | 48.31,26.67 48.31,22.86 | 48.31,22.86 SV8.19 | 48.31,26.67 SV6.19
  Bottom 0.254: SV1.37 48.31,86.26 48.31,72.08 49.38,71.02 49.38,36.73 48.31,35.66 SV2.37
N$40
  Top 0.254: SV21.20 SV21.19 SV20.20 SV20.19
N$41
  Top 0.254: SV2.26 33.07,38.1 33.07,43.13 SV18.13 33.07,43.28 33.07,46.94 SV16.13 33.07,47.09 33.07,50.75 SV14.13 33.07,50.9 33.07,54.56 SV12.13 33.07,54.71 33.07,58.37 SV17.13 33.07,58.52 33.07,62.18 SV15.13 33.07,62.33 33.07,65.99 SV13.13 33.07,66.14 33.07,69.8 SV11.13
  Bottom 0.254: SV1.26 33.07,88.85 33.07,87.78 34.14,86.72 34.14,71.02 33.07,69.95 SV11.13
N$42
  Top 0.254: 72.39,58.37 69.95,58.37 SV21.18 | SV20.17 77.42,58.37 74.98,58.37 SV20.18 74.83,58.37 72.39,58.37 | 72.39,58.37 SV21.17
N$43
  Top 0.254: SV2.30 SV18.15 SV16.15 SV14.15 SV12.15 SV17.15 SV15.15 SV13.15 SV11.15
  Bottom 0.254: SV1.30 38.1,87.94 37.03,86.87 37.03,71.02 38.1,69.95 SV11.15
N$44
  Top 0.254: 72.39,55.93 69.95,55.93 SV21.16 | SV20.15 77.42,55.93 74.98,55.93 SV20.16 74.83,55.93 72.39,55.93 | 72.39,55.93 SV21.15
N$45
  Top 0.254: SV2.34 43.28,38.1 43.28,43.13 SV18.17 43.28,43.28 43.28,46.94 SV16.17 43.28,47.09 43.28,50.75 SV14.17 43.28,50.9 43.28,54.56 SV12.17 43.28,54.71 43.28,58.37 SV17.17 43.28,58.52 43.28,62.18 SV15.17 43.28,62.33 43.28,65.99 SV13.17 43.28,66.14 43.28,69.8 SV11.17
  Bottom 0.254: SV11.17 44.35,71.02 44.35,86.72 43.28,87.78 43.28,88.85 SV1.34
N$46
  Top 0.254: SV21.14 SV21.13 SV20.14 SV20.13
N$47  (via drill 0.35)
  Top 0.254: SV32.15 57.15,12.65 59.59,12.65 SV32.13 59.74,12.65 62.18,12.65 SV32.11 62.33,12.65 64.77,12.65 | 72.39,12.65 69.95,12.65 SV32.5 69.8,12.65 67.36,12.65 SV32.7 67.21,12.65 64.77,12.65 | 72.39,12.65 74.83,12.65 SV32.1 | 72.39,12.65 SV32.3 | 64.77,12.65 SV32.9 | 48.31,38.1 48.31,43.13 SV18.19 48.31,43.28 48.31,46.94 SV16.19 48.31,47.09 48.31,50.75 SV14.19 48.31,50.9 48.31,54.56 SV12.19 48.31,54.71 48.31,58.37 SV17.19 48.31,58.52 48.31,62.18 SV15.19 48.31,62.33 48.31,65.99 SV13.19 48.31,66.14 48.31,69.8 SV11.19 48.31,69.95 49.38,71.02 49.38,86.72 48.31,87.78 48.31,88.85 SV1.38 | v49.53,29.11 49.53,36.88 48.31,38.1 | 48.31,38.1 SV2.38
  Bottom 0.254: SV32.15 57.15,14.93 51.05,21.03 50.29,21.03 49.53,21.79 v49.53,29.11
N$48
  Top 0.254: 64.77,16.46 62.33,16.46 SV31.12 62.18,16.46 59.74,16.46 SV31.14 59.59,16.46 57.15,16.46 SV31.16 57.15,17.53 51.97,22.71 51.97,37.03 50.9,38.1 | 72.39,16.46 69.95,16.46 SV31.6 69.8,16.46 67.36,16.46 SV31.8 67.21,16.46 64.77,16.46 | 72.39,16.46 74.83,16.46 SV31.2 | 72.39,16.46 SV31.4 | 64.77,16.46 SV31.10 | 50.9,38.1 50.9,43.13 SV18.20 50.9,43.28 50.9,46.94 SV16.20 50.9,47.09 50.9,50.75 SV14.20 50.9,50.9 50.9,54.56 SV12.20 50.9,54.71 50.9,58.37 SV17.20 50.9,58.52 50.9,62.18 SV15.20 50.9,62.33 50.9,65.99 SV13.20 50.9,66.14 50.9,69.8 SV11.20 51.97,71.02 51.97,86.72 50.9,87.78 50.9,88.85 SV1.40 | 50.9,38.1 SV2.40
N$49
  Top 0.254: 72.39,50.75 69.95,50.75 SV21.12 | SV20.11 77.42,50.75 74.98,50.75 SV20.12 74.83,50.75 72.39,50.75 | 72.39,50.75 SV21.11
N$50
  Top 0.254: 72.39,48.31 69.95,48.31 SV21.10 | SV20.9 77.42,48.31 74.98,48.31 SV20.10 74.83,48.31 72.39,48.31 | 72.39,48.31 SV21.9
N$51
  Top 0.254: SV21.8 SV21.7 SV20.8 SV20.7
N$52
  Top 0.254: 72.39,43.13 69.95,43.13 SV21.6 | SV20.5 77.42,43.13 74.98,43.13 SV20.6 74.83,43.13 72.39,43.13 | 72.39,43.13 SV21.5
N$53
  Top 0.254: 72.39,40.69 69.95,40.69 SV21.4 | SV20.3 77.42,40.69 74.98,40.69 SV20.4 74.83,40.69 72.39,40.69 | 72.39,40.69 SV21.3
N$54
  Top 0.254: SV21.2 SV21.1 SV20.2 SV20.1
N$55
  Top 0.254: SV23.40 82.6,86.41 85.04,86.41 SV23.39 85.19,86.41 87.63,86.41 | 87.63,86.41 90.07,86.41 SV22.39 | 87.63,86.41 SV22.40
N$56
  Top 0.254: SV23.38 SV23.37 SV22.38 SV22.37
N$57
  Top 0.254: SV23.36 82.6,81.23 85.04,81.23 SV23.35 85.19,81.23 87.63,81.23 | 87.63,81.23 90.07,81.23 SV22.35 | 87.63,81.23 SV22.36
N$58
  Top 0.254: SV23.34 82.6,78.79 85.04,78.79 SV23.33 85.19,78.79 87.63,78.79 | 87.63,78.79 90.07,78.79 SV22.33 | 87.63,78.79 SV22.34
N$59
  Top 0.254: SV23.32 SV23.31 SV22.32 SV22.31
N$60
  Top 0.254: SV23.30 82.6,73.61 85.04,73.61 SV23.29 85.19,73.61 87.63,73.61 | 87.63,73.61 90.07,73.61 SV22.29 | 87.63,73.61 SV22.30
N$61
  Top 0.254: SV23.28 82.6,71.17 85.04,71.17 SV23.27 85.19,71.17 87.63,71.17 | 87.63,71.17 90.07,71.17 SV22.27 | 87.63,71.17 SV22.28
N$62
  Top 0.254: SV23.26 SV23.25 SV22.26 SV22.25
N$63
  Top 0.254: SV23.24 82.6,65.99 85.04,65.99 SV23.23 85.19,65.99 87.63,65.99 | 87.63,65.99 90.07,65.99 SV22.23 | 87.63,65.99 SV22.24
N$64
  Top 0.254: SV23.22 82.6,63.55 85.04,63.55 SV23.21 85.19,63.55 87.63,63.55 | 87.63,63.55 90.07,63.55 SV22.21 | 87.63,63.55 SV22.22
N$65
  Top 0.254: SV23.20 SV23.19 SV22.20 SV22.19
N$66
  Top 0.254: SV23.18 82.6,58.37 85.04,58.37 SV23.17 85.19,58.37 87.63,58.37 | 87.63,58.37 90.07,58.37 SV22.17 | 87.63,58.37 SV22.18
N$67
  Top 0.254: SV23.16 82.6,55.93 85.04,55.93 SV23.15 85.19,55.93 87.63,55.93 | 87.63,55.93 90.07,55.93 SV22.15 | 87.63,55.93 SV22.16
N$68
  Top 0.254: SV23.14 SV23.13 SV22.14 SV22.13
N$69
  Top 0.254: SV23.12 82.6,50.75 85.04,50.75 SV23.11 85.19,50.75 87.63,50.75 | 87.63,50.75 90.07,50.75 SV22.11 | 87.63,50.75 SV22.12
N$70
  Top 0.254: SV23.10 82.6,48.31 85.04,48.31 SV23.9 85.19,48.31 87.63,48.31 | 87.63,48.31 90.07,48.31 SV22.9 | 87.63,48.31 SV22.10
N$71
  Top 0.254: SV23.8 SV23.7 SV22.8 SV22.7
N$72
  Top 0.254: SV23.6 82.6,43.13 85.04,43.13 SV23.5 85.19,43.13 87.63,43.13 | 87.63,43.13 90.07,43.13 SV22.5 | 87.63,43.13 SV22.6
N$73
  Top 0.254: SV23.4 82.6,40.69 85.04,40.69 SV23.3 85.19,40.69 87.63,40.69 | 87.63,40.69 90.07,40.69 SV22.3 | 87.63,40.69 SV22.4
N$74
  Top 0.254: SV23.2 SV23.1 SV22.2 SV22.1
N$75
  Top 0.254: SV25.40 57.15,86.41 59.59,86.41 SV25.39 59.74,86.41 62.18,86.41 SV24.40 62.33,86.41 64.77,86.41 SV24.39
N$76
  Top 0.254: SV25.38 SV25.37 SV24.38 SV24.37
N$77
  Top 0.254: SV25.36 57.15,81.23 59.59,81.23 SV25.35 59.74,81.23 62.18,81.23 SV24.36 62.33,81.23 64.77,81.23 SV24.35
N$78
  Top 0.254: SV25.34 57.15,78.79 59.59,78.79 SV25.33 59.74,78.79 62.18,78.79 SV24.34 62.33,78.79 64.77,78.79 SV24.33
N$79
  Top 0.254: SV25.32 SV25.31 SV24.32 SV24.31
N$80
  Top 0.254: SV25.30 57.15,73.61 59.59,73.61 SV25.29 59.74,73.61 62.18,73.61 SV24.30 62.33,73.61 64.77,73.61 SV24.29
N$81
  Top 0.254: SV25.28 57.15,71.17 59.59,71.17 SV25.27 59.74,71.17 62.18,71.17 SV24.28 62.33,71.17 64.77,71.17 SV24.27
N$82
  Top 0.254: SV25.26 SV25.25 SV24.26 SV24.25
N$83
  Top 0.254: SV25.24 57.15,65.99 59.59,65.99 SV25.23 59.74,65.99 62.18,65.99 SV24.24 62.33,65.99 64.77,65.99 SV24.23
N$84
  Top 0.254: SV25.22 57.15,63.55 59.59,63.55 SV25.21 59.74,63.55 62.18,63.55 SV24.22 62.33,63.55 64.77,63.55 SV24.21
N$85
  Top 0.254: SV25.20 SV25.19 SV24.20 SV24.19
N$86
  Top 0.254: SV25.18 57.15,58.37 59.59,58.37 SV25.17 59.74,58.37 62.18,58.37 SV24.18 62.33,58.37 64.77,58.37 SV24.17
N$87
  Top 0.254: SV25.16 57.15,55.93 59.59,55.93 SV25.15 59.74,55.93 62.18,55.93 SV24.16 62.33,55.93 64.77,55.93 SV24.15
N$88
  Top 0.254: SV25.14 SV25.13 SV24.14 SV24.13
N$89
  Top 0.254: SV25.12 57.15,50.75 59.59,50.75 SV25.11 59.74,50.75 62.18,50.75 SV24.12 62.33,50.75 64.77,50.75 SV24.11
N$90
  Top 0.254: SV25.10 57.15,48.31 59.59,48.31 SV25.9 59.74,48.31 62.18,48.31 SV24.10 62.33,48.31 64.77,48.31 SV24.9
N$91
  Top 0.254: SV25.8 SV25.7 SV24.8 SV24.7
N$92
  Top 0.254: SV25.6 57.15,43.13 59.59,43.13 SV25.5 59.74,43.13 62.18,43.13 SV24.6 62.33,43.13 64.77,43.13 SV24.5
N$93
  Top 0.254: SV25.4 57.15,40.69 59.59,40.69 SV25.3 59.74,40.69 62.18,40.69 SV24.4 62.33,40.69 64.77,40.69 SV24.3
N$94
  Top 0.254: SV25.2 SV25.1 SV24.2 SV24.1
N$95
  Top 0.254: 85.19,26.67 85.19,29.11 SV29.6 85.19,29.26 85.19,31.7 SV29.5 | SV26.6 85.19,14.02 85.19,16.46 SV26.5 85.19,16.61 85.19,19.05 | 85.19,19.05 85.19,21.49 SV27.5 85.19,21.64 85.19,24.08 SV28.6 85.19,24.23 85.19,26.67 | 85.19,19.05 SV27.6 | 85.19,26.67 SV28.5 | 25.45,22.86 25.45,19.05 | 25.45,7.62 25.45,3.81 SV9.10 | 25.45,15.24 25.45,11.43 | 25.45,11.43 25.45,7.62 | 25.45,7.62 SV7.10 | 25.45,11.43 SV5.10 | 25.45,15.24 25.45,19.05 | 25.45,19.05 SV10.10 | 25.45,15.24 SV3.10 | 25.45,30.48 25.45,26.67 | 25.45,30.48 25.45,35.51 SV2.19 24.23,36.73 24.23,71.02 25.3,72.08 25.3,86.26 SV1.19 | 25.45,30.48 SV4.10 | 25.45,26.67 25.45,22.86 | 25.45,22.86 SV8.10 | 25.45,26.67 SV6.10
  Bottom 0.254: SV19.5 86.41,22.86 85.19,24.08 SV28.6 | SV29.5 85.04,31.85 51.66,31.85 51.21,32.31 32.61,32.31 31.55,31.24 31.55,29.26 30.94,28.65 27.28,28.65 25.45,30.48 SV4.10
N$96
  Top 0.254: SV29.3 SV29.4 SV28.3 | SV26.4 SV26.3 SV27.4 SV27.3 SV28.4 | 28.04,22.86 28.04,19.05 | 28.04,7.62 28.04,3.81 SV9.11 | 28.04,15.24 28.04,11.43 | 28.04,11.43 28.04,7.62 | 28.04,7.62 SV7.11 | 28.04,11.43 SV5.11 | 28.04,15.24 28.04,19.05 | 28.04,19.05 SV10.11 | 28.04,15.24 SV3.11 | 28.04,30.48 28.04,26.67 | 28.04,30.48 28.04,35.51 SV2.21 | 28.04,30.48 SV4.11 | 28.04,26.67 28.04,22.86 | 28.04,22.86 SV8.11 | 28.04,26.67 SV6.11
  Bottom 0.254: 88.62,25.22 87.63,24.23 SV28.4 | 88.62,25.22 88.7,25.3 102.87,25.3 SV19.6 | SV28.3 87.63,26.21 88.62,25.22 | SV2.21 29.11,36.73 29.11,71.02 28.04,72.08 28.04,86.26 SV1.21 | SV29.3 87.63,31.85 86.56,31.85 85.5,32.92 30.48,32.92 28.04,30.48 SV4.11
N$97
  Top 0.254: 90.22,26.67 90.22,29.11 SV29.2 90.22,29.26 90.22,31.7 SV29.1 | SV26.2 90.22,14.02 90.22,16.46 SV26.1 90.22,16.61 90.22,19.05 | 90.22,20.27 90.22,21.49 SV27.1 90.22,21.64 90.22,24.08 SV28.2 90.22,24.23 90.22,26.67 | 90.22,20.27 90.22,19.05 | 90.22,20.27 102.87,20.27 SV19.4 | 90.22,19.05 SV27.2 | 90.22,26.67 SV28.1 | SV9.12 SV7.12 SV5.12 SV3.12 SV10.12 SV8.12 SV6.12 SV4.12 SV2.23 30.48,35.66 29.41,36.73 29.41,71.02 30.48,72.08 SV1.23
  Bottom 0.254: SV9.12 32.31,1.98 77.11,1.98 89,13.87 90.07,13.87 SV26.2
N$101
  Top 0.254: SV2.2 2.59,38.1 2.59,43.13 SV18.1 2.59,43.28 2.59,46.94 SV16.1 2.59,47.09 2.59,50.75 SV14.1 2.59,50.9 2.59,54.56 SV12.1 2.59,54.71 2.59,58.37 SV17.1 2.59,58.52 2.59,62.18 SV15.1 2.59,62.33 2.59,65.99 SV13.1 2.59,66.14 2.59,69.8 SV11.1 1.37,71.02 1.37,86.72 2.44,87.78 2.44,88.85 SV1.2 2.59,89 3.66,89 5.18,90.53 98.75,90.53 102.87,86.41 SV41.6 SV41.5 SV40.6 SV40.5 SV39.6 SV39.5 SV38.6 SV38.5 SV37.6 SV37.5 SV36.6 SV36.5 SV35.6 SV35.5 SV34.6 SV34.5 SV19.8
N$105
  Top 0.254: SV2.6 SV18.3 SV16.3 SV14.3 SV12.3 SV17.3 SV15.3 SV13.3 SV11.3 | 100.43,68.58 100.43,71.02 SV38.4 100.43,71.17 100.43,73.61 SV39.3 100.43,73.76 100.43,76.2 | 100.43,83.82 100.43,86.26 SV41.4 | 100.43,76.2 100.43,78.64 SV40.3 100.43,78.79 100.43,81.23 SV40.4 100.43,81.38 100.43,83.82 | 100.43,83.82 SV41.3 | 100.43,76.2 SV39.4 | 100.43,53.34 100.43,55.78 SV35.4 100.43,55.93 100.43,58.37 SV36.3 100.43,58.52 100.43,60.96 | 100.43,60.96 100.43,63.4 SV37.3 100.43,63.55 100.43,65.99 SV37.4 100.43,66.14 100.43,68.58 | 100.43,60.96 SV36.4 | SV19.7 102.87,28.04 100.43,30.48 100.43,48.16 SV34.3 100.43,48.31 100.43,50.75 SV34.4 100.43,50.9 100.43,53.34 | 100.43,53.34 SV35.3 | 100.43,68.58 SV38.3
  Bottom 0.254: SV11.3 7.62,69.95 8.69,71.02 8.69,86.87 7.62,87.94 SV1.6 7.62,89 8.69,89 9.75,90.07 96.62,90.07 SV41.4
N$106
  Top 0.254: 97.84,83.82 97.84,86.26 SV41.2 97.69,86.41 91.59,86.41 87.94,90.07 7.32,90.07 6.25,89 6.25,88.54 5.18,87.48 3.66,87.48 SV1.1 2.59,86.26 2.59,72.08 3.66,71.02 3.66,36.73 2.59,35.66 SV2.1 2.59,35.51 2.59,30.48 | 97.84,76.2 97.84,78.64 SV40.1 97.84,78.79 97.84,81.23 SV40.2 97.84,81.38 97.84,83.82 | 97.84,83.82 SV41.1 | SV34.1 97.84,48.31 97.84,50.75 SV34.2 97.84,50.9 97.84,53.34 | 97.84,53.34 97.84,55.78 SV35.2 97.84,55.93 97.84,58.37 SV36.1 97.84,58.52 97.84,60.96 | 97.84,53.34 SV35.1 | 97.84,60.96 97.84,63.4 SV37.1 97.84,63.55 97.84,65.99 SV37.2 97.84,66.14 97.84,68.58 | 97.84,68.58 97.84,71.02 SV38.2 97.84,71.17 97.84,73.61 SV39.1 97.84,73.76 97.84,76.2 | 97.84,68.58 SV38.1 | 97.84,60.96 SV36.2 | 97.84,76.2 SV39.2 | 2.59,22.86 2.59,19.05 | 2.59,7.62 2.59,3.81 SV9.1 | 2.59,15.24 2.59,11.43 | 2.59,11.43 2.59,7.62 | 2.59,7.62 SV7.1 | 2.59,11.43 SV5.1 | 2.59,15.24 2.59,19.05 | 2.59,19.05 SV10.1 | 2.59,15.24 SV3.1 | 2.59,30.48 2.59,26.67 | 2.59,30.48 SV4.1 | 2.59,26.67 2.59,22.86 | 2.59,22.86 SV8.1 | 2.59,26.67 SV6.1
N$322  (via drill 0.35)
  Top 0.254: 5.18,22.86 5.18,19.05 | 5.18,7.62 5.18,3.81 SV9.2 | 5.18,15.24 5.18,11.43 | 5.18,11.43 5.18,7.62 | 5.18,7.62 SV7.2 | 5.18,11.43 SV5.2 | 5.18,15.24 5.18,19.05 | 5.18,19.05 SV10.2 | 5.18,15.24 SV3.2 | SV30.16 SV30.14 SV30.12 SV30.10 SV30.8 SV30.6 SV30.4 SV30.2 v53.95,33.68 | 5.18,30.48 5.18,26.67 | 5.18,30.48 5.18,35.51 SV2.3 | 5.18,30.48 SV4.2 | 5.18,26.67 5.18,22.86 | 5.18,22.86 SV8.2 | 5.18,26.67 SV6.2
  Bottom 0.254: 6.25,39.17 6.25,36.73 SV2.3 | 6.25,39.17 6.25,71.02 5.18,72.08 5.18,86.26 SV1.3 | v53.95,33.68 23.16,33.68 21.49,35.36 21.49,35.97 20.42,37.03 19.81,37.03 18.9,37.95 18.9,38.56 18.29,39.17 6.25,39.17
N$340
  Top 0.254: 50.9,22.86 50.9,19.05 | 50.9,7.62 50.9,3.81 SV9.20 | 50.9,15.24 50.9,11.43 | 50.9,11.43 50.9,7.62 | 50.9,7.62 SV7.20 | 50.9,11.43 SV5.20 | 50.9,15.24 50.9,19.05 | 50.9,19.05 SV10.20 | 50.9,15.24 SV3.20 | 50.9,30.48 50.9,26.67 | 50.9,30.48 50.9,35.51 SV2.39 | 50.9,30.48 SV4.20 | 50.9,26.67 50.9,22.86 | 50.9,22.86 SV8.20 | 50.9,26.67 SV6.20
  Bottom 0.254: SV2.39 51.97,36.73 51.97,71.02 50.9,72.08 50.9,86.26 SV1.39
N$348
  Top 0.254: SV2.16 20.42,38.1 20.42,43.13 SV18.8 20.42,43.28 20.42,46.94 SV16.8 20.42,47.09 20.42,50.75 SV14.8 20.42,50.9 20.42,54.56 SV12.8 20.42,54.71 20.42,58.37 SV17.8 20.42,58.52 20.42,62.18 SV15.8 20.42,62.33 20.42,65.99 SV13.8 20.42,66.14 20.42,69.8 SV11.8
  Bottom 0.254: SV1.16 20.42,88.85 20.42,87.78 21.49,86.72 21.49,71.32 20.42,70.26 20.42,69.95 SV11.8
N$606
  Top 0.254: SV11.12 SV13.12 SV15.12 SV17.12 SV12.12 SV14.12 SV16.12 SV18.12 SV2.24 30.48,37.49 31.55,36.42 31.55,3.05 32.61,1.98 79.7,1.98 95.4,17.68 102.87,17.68 SV19.3
  Bottom 0.254: SV1.24 30.48,87.94 31.55,86.87 31.55,71.02 30.48,69.95 SV11.12
N$607
  Top 0.254: SV2.20 25.45,38.1 25.45,43.13 SV18.10 25.45,43.28 25.45,46.94 SV16.10 25.45,47.09 25.45,50.75 SV14.10 25.45,50.9 25.45,54.56 SV12.10 25.45,54.71 25.45,58.37 SV17.10 25.45,58.52 25.45,62.18 SV15.10 25.45,62.33 25.45,65.99 SV13.10 25.45,66.14 25.45,69.8 SV11.10 25.45,69.95 26.52,71.02 26.52,86.72 25.45,87.78 25.45,88.85 SV1.20

### Text on the board
tNames: 3v3 | GND | 5v | SPI | I2C | IT8951 | SDA | 5v | SCL | GND | MISO | MOSI | I2S | SCK | LRCLK | CS | DATAOUT | RST | DATAIN | HRDY | BITCLK | MOSI | MISO | SCK